# EAGLE design OMHOT (EAGLE 5.12)
VERSION: OMHOT_3_2

## Sheet 1 of 2
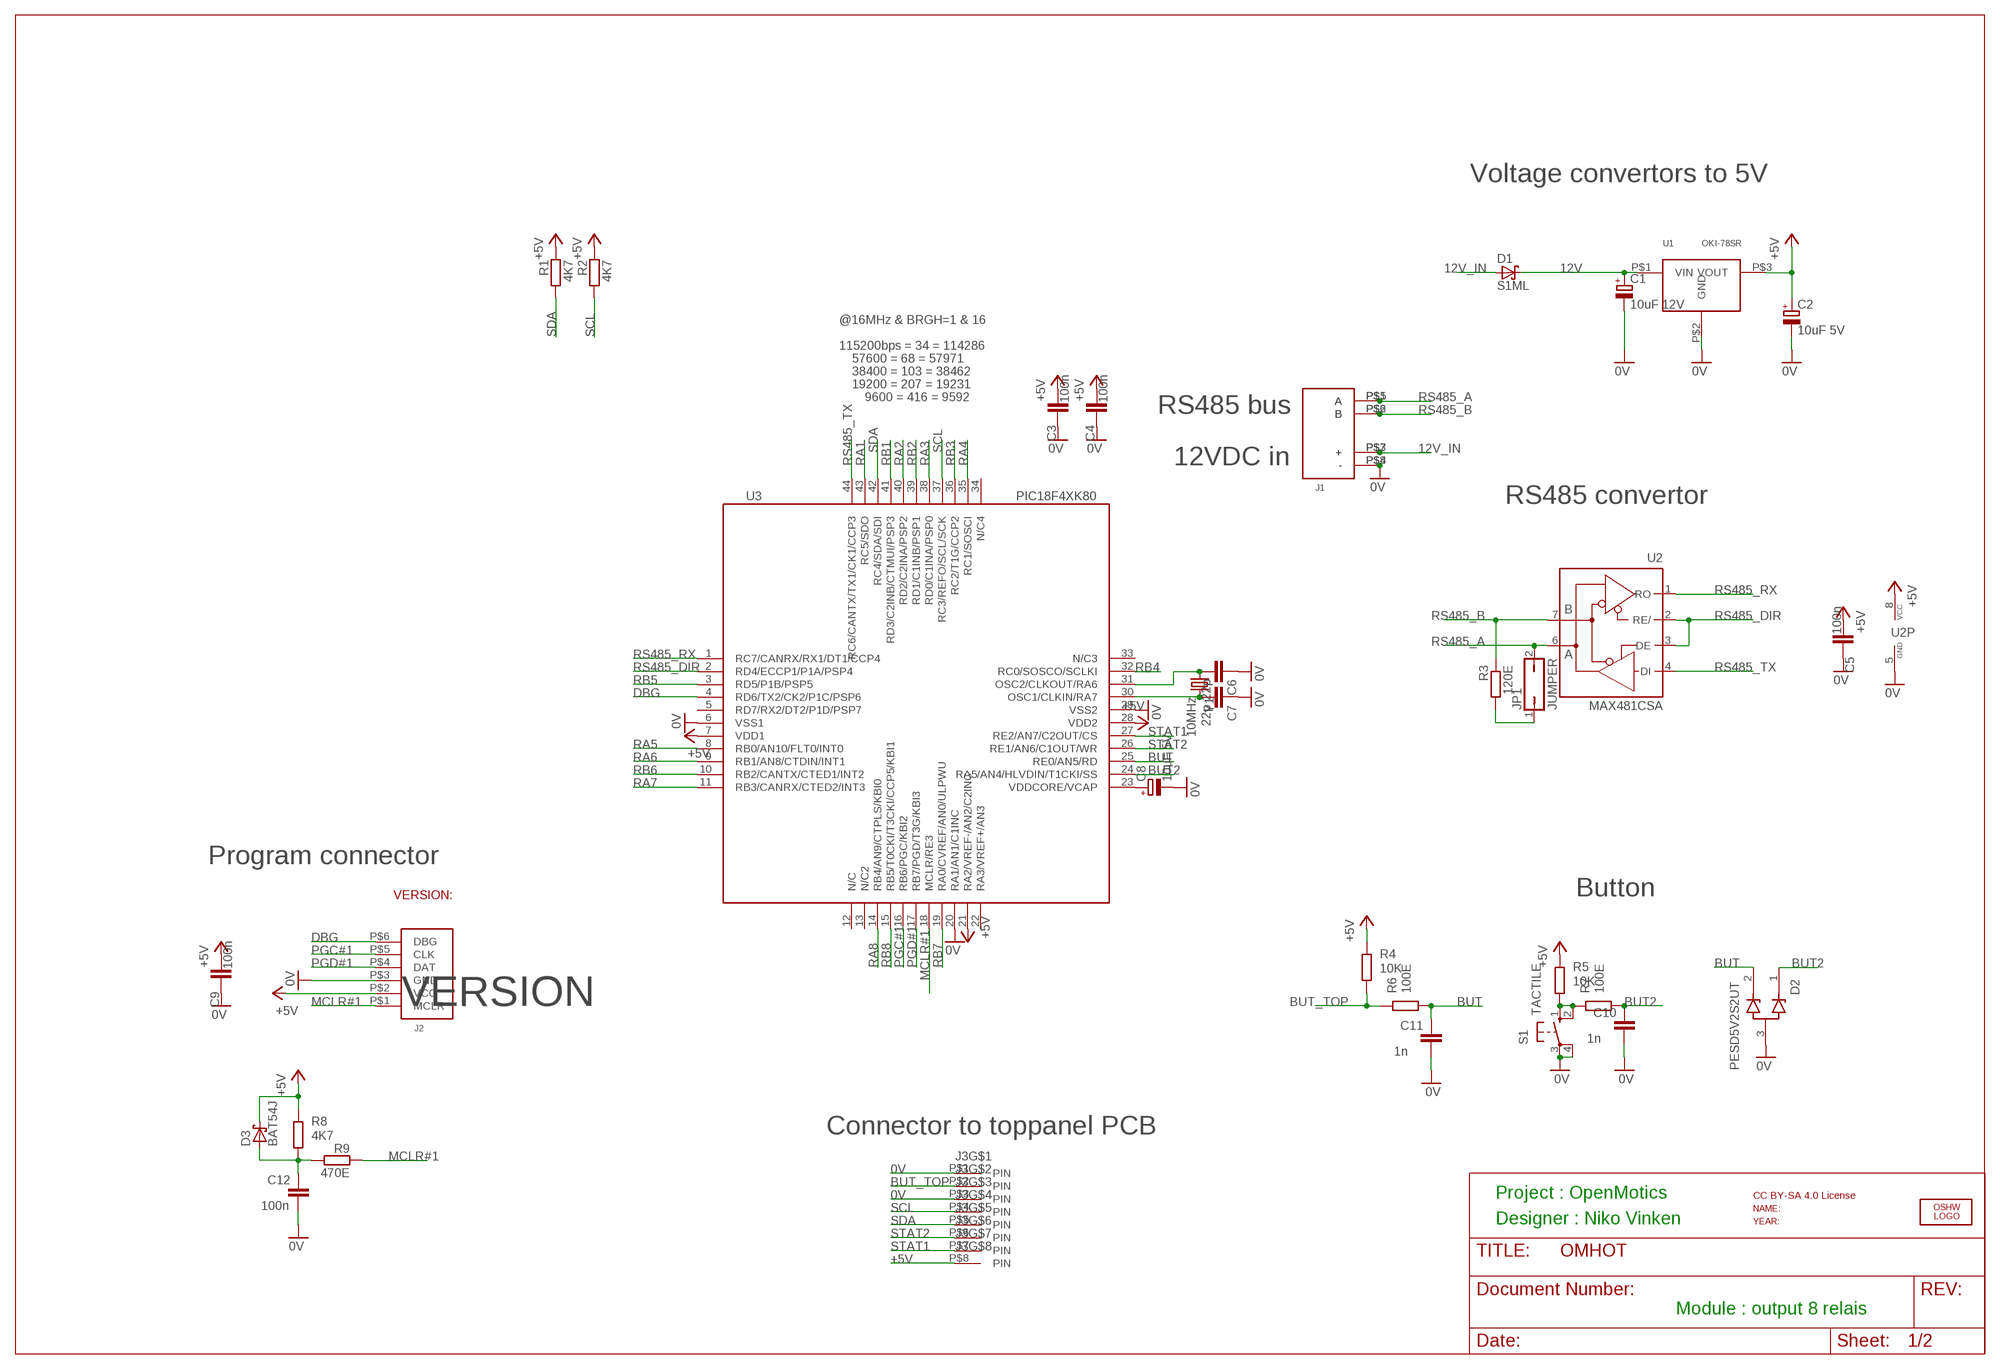
[diagram p0: schematic, sheet 1]

### Parts
C1  10uF 12V  CPOL-EUA3216-18W  [A3216-18W]
C2  10uF 5V  CPOL-EUA3216-18W  [A3216-18W]
C3  100n  C-EUC0603  [C0603]
C4  100n  C-EUC0603  [C0603]
C5  100n  C-EUC0603  [C0603]
C6  22p  C-EUC0603  [C0603]
C7  22p  C-EUC0603  [C0603]
C8  10uF 5V  CPOL-EUA3216-18W  [A3216-18W]
C9  100n  C-EUC0603  [C0603]
C10  1n  C-EUC0603  [C0603]
C11  1n  C-EUC0603  [C0603]
C12  100n  C-EUC0603  [C0603]
D1  S1ML  SMF5.0AT1  [SOD123FL]
D2  PESD5V2S2UT  PESD3V3S2UAT  [SOT23]
D3  BAT54J  [SOD323_REFLOW]
J1  PTDA_1.5_4-PH_5.0  [PTDA_1.5_X-PH_5.0]
J2  PROG_CON  [PROG_CON_WITH_VERSION]
J3  8PIN_CON_AMP  [8PIN_CON_AMP]
JP1  JUMPER  JP1Q  [JP1S]
LOGO2  OSHW_LOGO_FILLX0150-NT  [OSHW_FILLX150_NOTEXT]
R1  4K7  R-EU_R0603  [R0603]
R2  4K7  R-EU_R0603  [R0603]
R3  120E  R-EU_R1206  [R1206]
R4  10K  R-EU_R0603  [R0603]
R5  10K  R-EU_R0603  [R0603]
R6  100E  R-EU_R0603  [R0603]
R7  100E  R-EU_R0603  [R0603]
R8  4K7  R-EU_R0603  [R0603]
R9  470E  R-EU_R0603  [R0603]
S1  TACTILE  10-XX  [B3F-10XX]
U1  OKI-78SR  [OKI-78SR]
U2  MAX481CSA  [SO08]
U3  PIC18F4XK80  [TQFP44]
U$7  CC_BY_SA  [CC_BY_SA]
Y1  10MHz  CRYSTALSM49  [SM49]

### Nets
0V: C1.- C2.- C3.2 C4.2 C5.2 C6.1 C7.1 C8.- C9.2 C10.1 C11.1 C12.1 D2.3 J1.P$4(-) J1.P$8(-) J2.P$3(GND) J3.P$1 J3.P$3 S1.3(P) S1.4(P1) U1.P$2(GND) U2.5(GND) U3.6(VSS1) U3.20(RA1/AN1/C1INC) U3.29(VSS2) ; also sheet 2
12V: C1.+ D1.C U1.P$1(VIN)
12V_IN: D1.A J1.P$3(+) J1.P$7(+)
+5V: C2.+ C3.1 C4.1 C5.1 C9.1 D3.1 J2.P$2(VCC) J3.P$8 R1.1 R2.1 R4.2 R5.2 R8.2 U1.P$3(VOUT) U2.8(VCC) U3.7(VDD1) U3.21(RA2/VREF-/AN2/C2INC) U3.28(VDD2) ; also sheet 2
BUT: C11.2 D2.2 R6.1 U3.25(RE0/AN5/RD)
BUT2: C10.2 D2.1 R7.1 U3.24(RA5/AN4/HLVDIN/T1CKI/SS)
BUT3: R5.1 R7.2 S1.1(S) S1.2(S1)
BUT_TOP: J3.P$2 R4.1 R6.2
DBG: J2.P$6(DBG) U3.4(RD6/TX2/CK2/P1C/PSP6)
MCLR#1: J2.P$1(MCLR) R9.1 U3.18(MCLR/RE3)
N$30: C6.2 U3.31(OSC2/CLKOUT/RA6) Y1.1
N$32: C7.2 U3.30(OSC1/CLKIN/RA7) Y1.2
N$33: C8.+ U3.23(VDDCORE/VCAP)
N$36: JP1.1 R3.2
N$444: C12.2 D3.2 R8.1 R9.2
PGC#1: J2.P$5(CLK) U3.16(RB6/PGC/KBI2)
PGD#1: J2.P$4(DAT) U3.17(RB7/PGD/T3G/KBI3)
RA1: U3.43(RC5/SDO) ; also sheet 2
RA2: U3.40(RD2/C2INA/PSP2) ; also sheet 2
RA3: U3.38(RD0/C1INA/PSP0) ; also sheet 2
RA4: U3.35(RC1/SOSCI) ; also sheet 2
RA5: U3.8(RB0/AN10/FLT0/INT0) ; also sheet 2
RA6: U3.9(RB1/AN8/CTDIN/INT1) ; also sheet 2
RA7: U3.11(RB3/CANRX/CTED2/INT3) ; also sheet 2
RA8: U3.14(RB4/AN9/CTPLS/KBI0) ; also sheet 2
RB1: U3.41(RD3/C2INB/CTMUI/PSP3) ; also sheet 2
RB2: U3.39(RD1/C1INB/PSP1) ; also sheet 2
RB3: U3.36(RC2/T1G/CCP2) ; also sheet 2
RB4: U3.32(RC0/SOSCO/SCLKI) ; also sheet 2
RB5: U3.3(RD5/P1B/PSP5) ; also sheet 2
RB6: U3.10(RB2/CANTX/CTED1/INT2) ; also sheet 2
RB7: U3.19(RA0/CVREF/AN0/ULPWU) ; also sheet 2
RB8: U3.15(RB5/T0CKI/T3CKI/CCP5/KBI1) ; also sheet 2
RS485_A: J1.P$1(A) J1.P$5(A) JP1.2 U2.6(A)
RS485_B: J1.P$2(B) J1.P$6(B) R3.1 U2.7(B)
RS485_DIR: U2.2(RE/) U2.3(DE) U3.2(RD4/ECCP1/P1A/PSP4)
RS485_RX: U2.1(RO) U3.1(RC7/CANRX/RX1/DT1/CCP4)
RS485_TX: U2.4(DI) U3.44(RC6/CANTX/TX1/CK1/CCP3)
SCL: J3.P$4 R2.2 U3.37(RC3/REFO/SCL/SCK)
SDA: J3.P$5 R1.2 U3.42(RC4/SDA/SDI)
STAT1: J3.P$7 U3.27(RE2/AN7/C2OUT/CS)
STAT2: J3.P$6 U3.26(RE1/AN6/C1OUT/WR)
Unconnected: U3.5(RD7/RX2/DT2/P1D/PSP7) U3.12(N/C) U3.13(N/C2) U3.22(RA3/VREF+/AN3) U3.33(N/C3) U3.34(N/C4)

### Notes on the sheet
- Voltage convertors to 5V
- @16MHz & BRGH=1 & 16
- 115200bps = 34 = 114286
- 57600 = 68 = 57971
- 38400 = 103 = 38462
- 19200 = 207 = 19231
- 9600 = 416 = 9592
- RS485 bus
- 12VDC in
- RS485 convertor
- Program connector
- Button
- Connector to toppanel PCB
- Project : OpenMotics
- Designer : Niko Vinken
- Module : output 8 relais

## Sheet 2 of 2
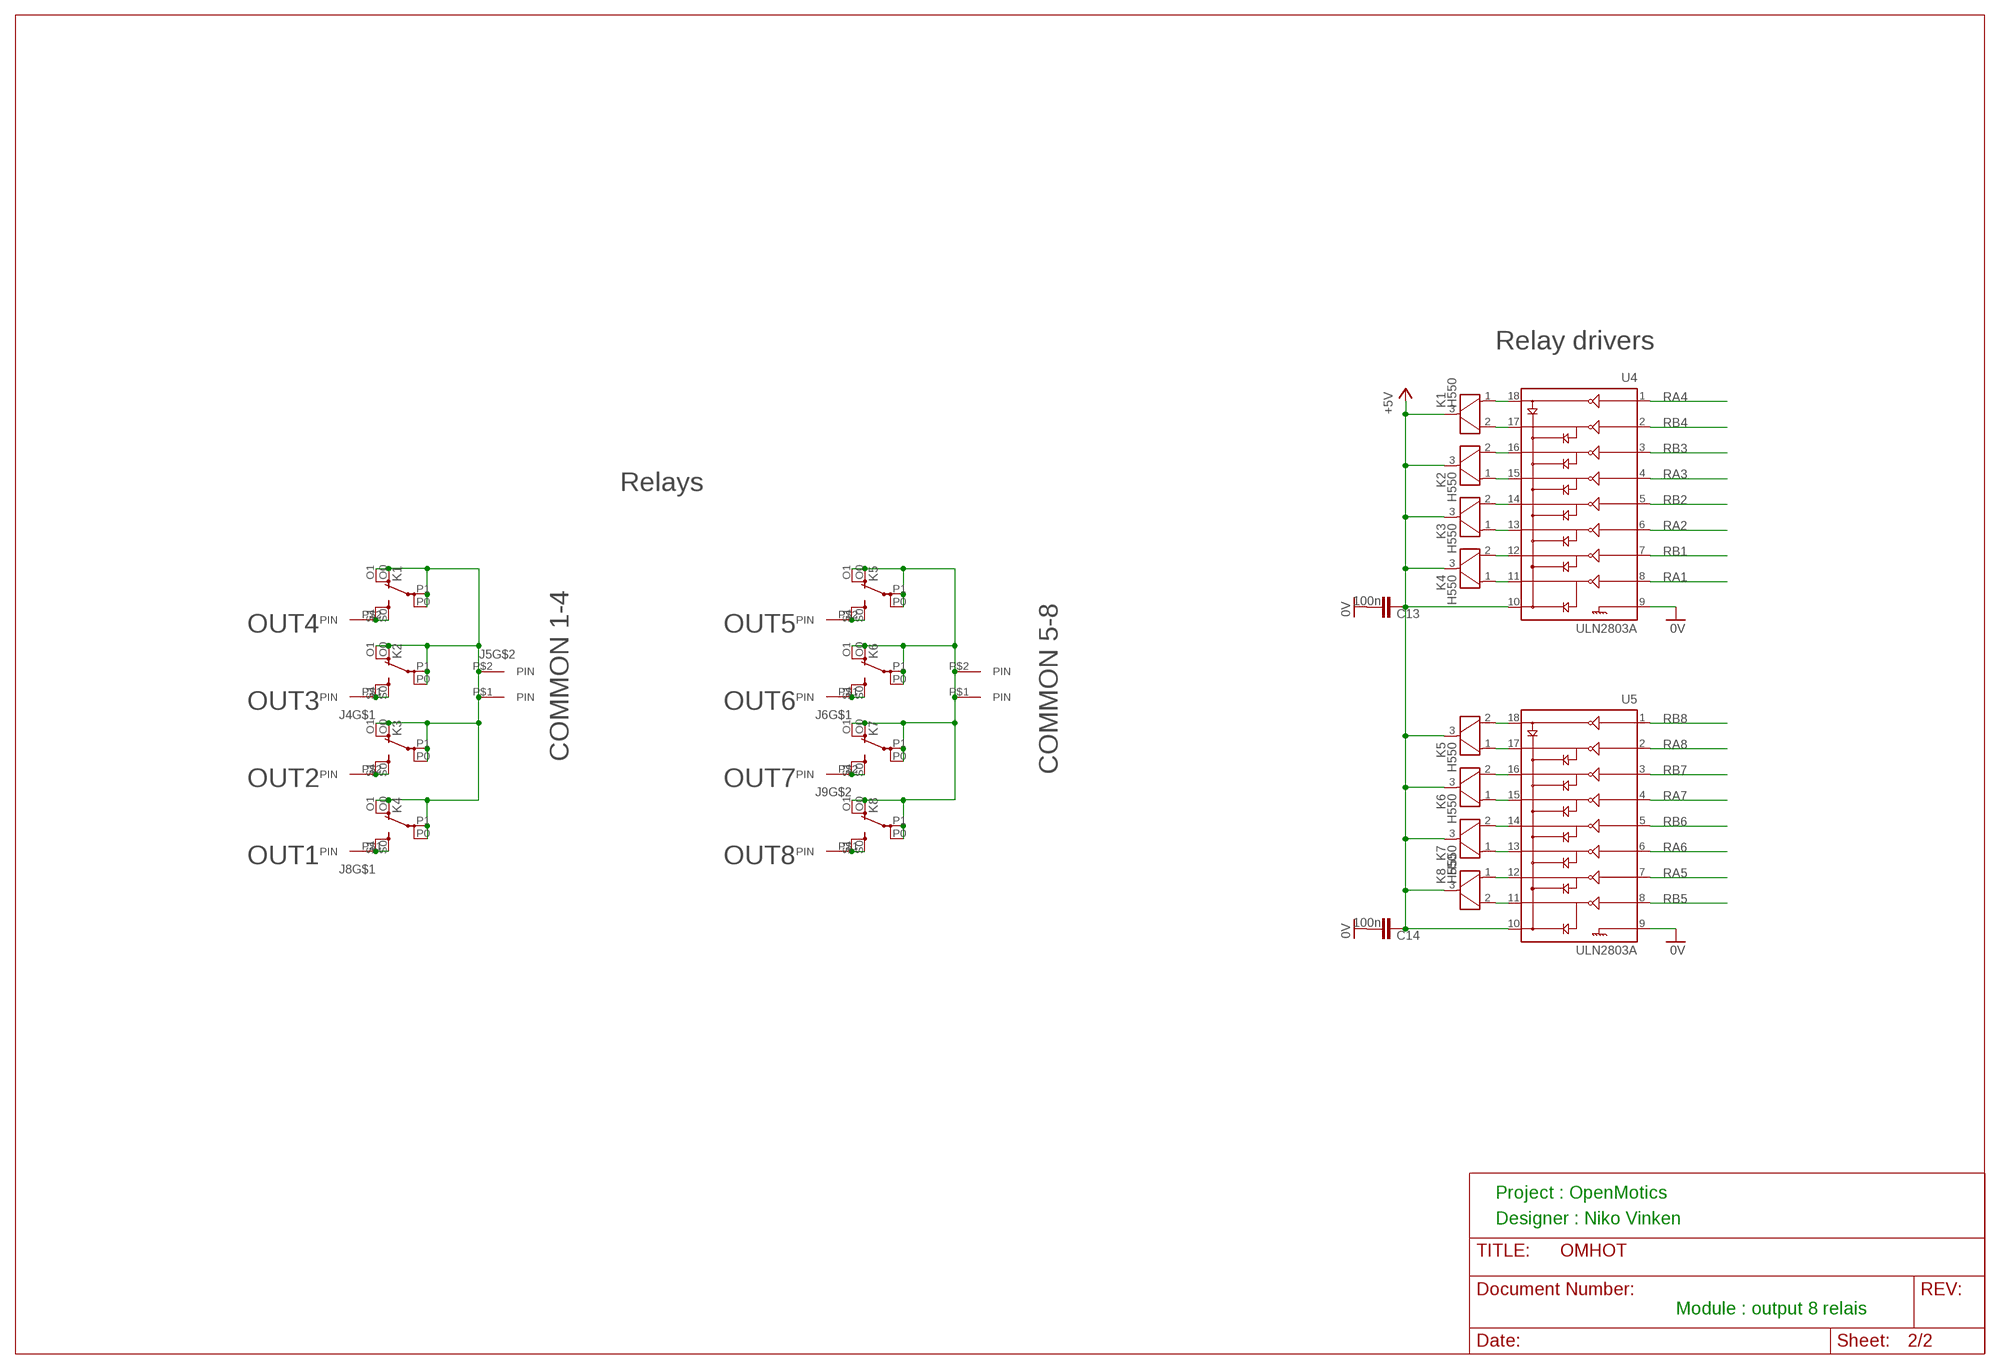
[diagram p1: schematic, sheet 2]

### Parts
C13  100n  C-EUC0603  [C0603]
C14  100n  C-EUC0603  [C0603]
J4  TERMINAL_2PIN  TERMINAL_2PIN7.62MM  [2PIN_TERMINAL_7.6MM]
J5  TERMINAL_2PIN  TERMINAL_2PIN7.62MM  [2PIN_TERMINAL_7.6MM]
J6  TERMINAL_2PIN  TERMINAL_2PIN7.62MM  [2PIN_TERMINAL_7.6MM]
J7  TERMINAL_2PIN  TERMINAL_2PIN7.62MM  [2PIN_TERMINAL_7.6MM]
J8  TERMINAL_2PIN  TERMINAL_2PIN7.62MM  [2PIN_TERMINAL_7.6MM]
J9  TERMINAL_2PIN  TERMINAL_2PIN7.62MM  [2PIN_TERMINAL_7.6MM]
K1  H550  [H550]
K2  H550  [H550]
K3  H550  [H550]
K4  H550  [H550]
K5  H550  [H550]
K6  H550  [H550]
K7  H550  [H550]
K8  H550  [H550]
U4  ULN2803A  [SOIC18]
U5  ULN2803A  [SOIC18]
U$4  CNMB/6  [CNMB/6-]  (not placed on a sheet)

### Nets
0V: C13.1 C14.1 U4.9 U5.9 ; also sheet 1
+5V: C13.2 C14.2 K1.3 K2.3 K3.3 K4.3 K5.3 K6.3 K7.3 K8.3 U4.10 U5.10 ; also sheet 1
N$1: J6.P$2 K5.S0(2:S) K5.S1(2:S)
N$3: J8.P$2 K3.S0(2:S) K3.S1(2:S)
N$4: J8.P$1 K4.S0(2:S) K4.S1(2:S)
N$5: J6.P$1 K6.S0(2:S) K6.S1(2:S)
N$6: K4.1 U4.11
N$7: K4.2 U4.12
N$8: J4.P$2 K1.S0(2:S) K1.S1(2:S)
N$9: K3.1 U4.13
N$10: J9.P$2 K7.S0(2:S) K7.S1(2:S)
N$11: J9.P$1 K8.S0(2:S) K8.S1(2:S)
N$12: J5.P$1 J5.P$2 K1.O0(2:O) K1.O1(2:O) K1.P0(2:P) K1.P1(2:P) K2.O0(2:O) K2.O1(2:O) K2.P0(2:P) K2.P1(2:P) K3.O0(2:O) K3.O1(2:O) K3.P0(2:P) K3.P1(2:P) K4.O0(2:O) K4.O1(2:O) K4.P0(2:P) K4.P1(2:P)
N$13: J4.P$1 K2.S0(2:S) K2.S1(2:S)
N$14: K3.2 U4.14
N$15: K2.1 U4.15
N$16: K2.2 U4.16
N$17: K1.1 U4.18
N$18: K1.2 U4.17
N$19: K5.1 U5.17
N$20: J7.P$1 J7.P$2 K5.O0(2:O) K5.O1(2:O) K5.P0(2:P) K5.P1(2:P) K6.O0(2:O) K6.O1(2:O) K6.P0(2:P) K6.P1(2:P) K7.O0(2:O) K7.O1(2:O) K7.P0(2:P) K7.P1(2:P) K8.O0(2:O) K8.O1(2:O) K8.P0(2:P) K8.P1(2:P)
N$21: K5.2 U5.18
N$22: K6.1 U5.15
N$23: K6.2 U5.16
N$24: K7.1 U5.13
N$25: K7.2 U5.14
N$26: K8.1 U5.12
N$27: K8.2 U5.11
RA1: U4.8 ; also sheet 1
RA2: U4.6 ; also sheet 1
RA3: U4.4 ; also sheet 1
RA4: U4.1 ; also sheet 1
RA5: U5.7 ; also sheet 1
RA6: U5.6 ; also sheet 1
RA7: U5.4 ; also sheet 1
RA8: U5.2 ; also sheet 1
RB1: U4.7 ; also sheet 1
RB2: U4.5 ; also sheet 1
RB3: U4.3 ; also sheet 1
RB4: U4.2 ; also sheet 1
RB5: U5.8 ; also sheet 1
RB6: U5.5 ; also sheet 1
RB7: U5.3 ; also sheet 1
RB8: U5.1 ; also sheet 1

### Notes on the sheet
- Relay drivers
- Relays
- OUT4 | OUT5
- OUT3 | OUT6
- COMMON 1-4
- COMMON 5-8
- OUT2 | OUT7
- OUT1 | OUT8
- Project : OpenMotics
- Designer : Niko Vinken
- Module : output 8 relais

## Library data of the parts
C1 C2 C8 = resistor:CPOL-EU: POLARIZED CAPACITOR, European symbol
C3-C7 C9-C14 = resistor:C-EU: CAPACITOR, European symbol
D1 = diode:SMF5.0AT1: 200 W Transient Voltage Suppressor Source: Data sheet <http://www.onsemi.com/pub_link/Collateral/SMF5.0AT1-D.PDF>
D2 = OpenMotics:PESD3V3S2UAT
D3 = OpenMotics:BAT54J
J1 = OpenMotics:PTDA_1.5_4-PH_5.0
J2 = OpenMotics:PROG_CON
J3 = OpenMotics:8PIN_CON_AMP
J4-J9 = OpenMotics:TERMINAL_2PIN
JP1 = jumper:JP1Q: JUMPER
K1-K8 = relay:H550: RELAY bistable, 1 x switch, high current
LOGO2 = ohw-logo:OSHW_LOGO_FILL
R1-R9 = resistor:R-EU_: RESISTOR, European symbol
S1 = switch-omron:10-XX: OMRON SWITCH; MPN: B3F-1000; OC_FARNELL: 176432; OC_NEWARK: 36M3542
U1 = OpenMotics:OKI-78SR
U2 = maxim:MAX481CSA: RS485 TRANSEIVER
U3 = OpenMotics:PIC18F4XK80
U4 U5 = OpenMotics:ULN2803A
U$4 = OpenMotics:CNMB/6
U$7 = OpenMotics:CC_BY_SA
Y1 = crystal:CRYSTAL: CRYSTAL

## Board
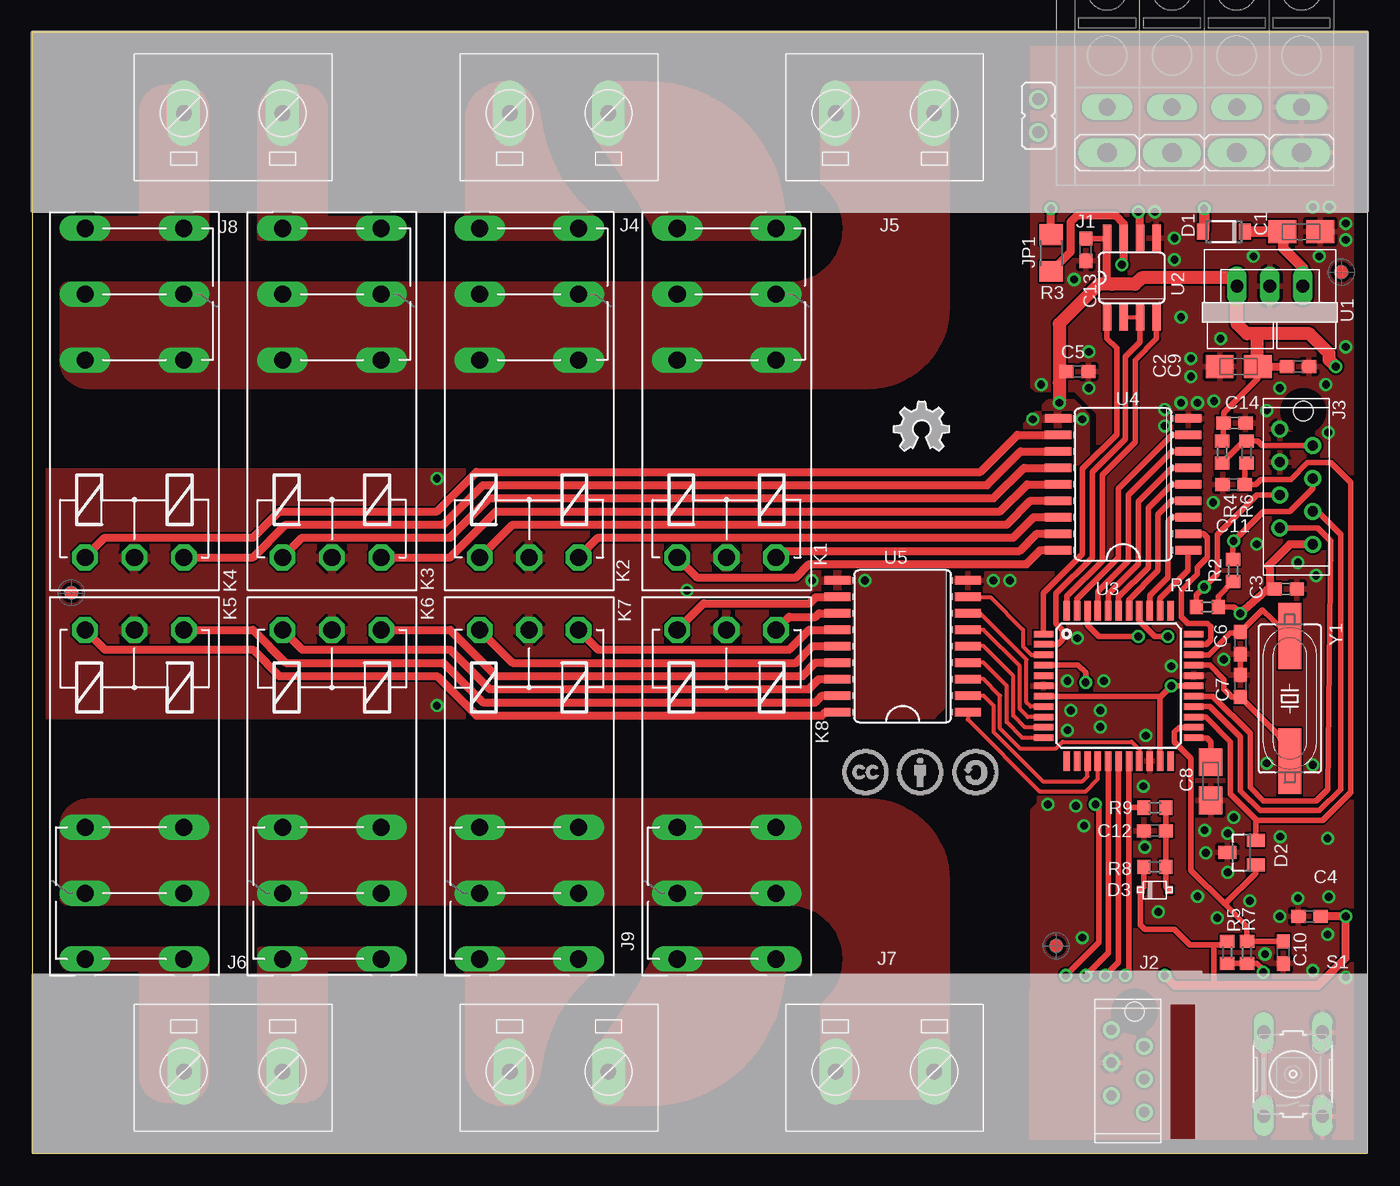
[diagram p2: board, top side]
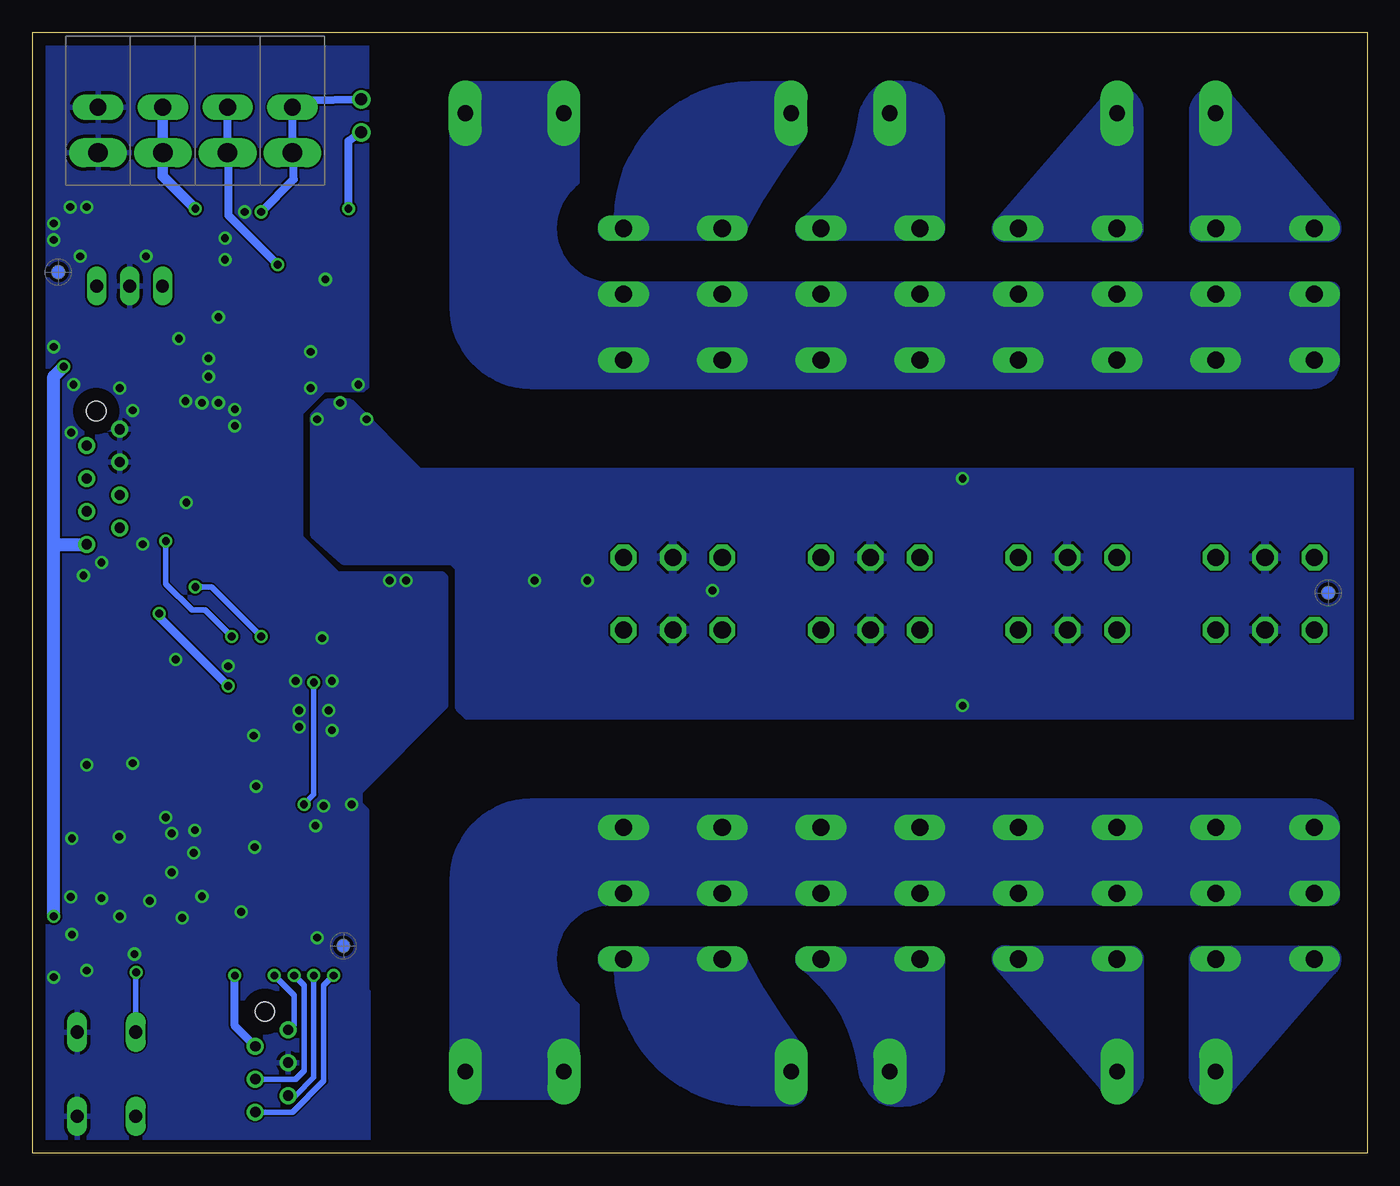
[diagram p3: board, bottom side, seen from below]

Size 103 x 86.5 mm. Coordinates in mm from the lower left corner, seen from the top.
Outline: 0,0 103,0 103,86.5 0,86.5 0,0
Copper layers (1+16): Top 0.035mm / dielectric 1.5mm / Bottom 0.035mm
Design rules "default *": minimum track width 10mil, minimum drill 24mil, track to track 6mil, track to pad 6mil, pad to pad 6mil, via to via 6mil, smd to smd 6mil, copper to edge 40mil, drill to drill 8mil, minimum pad ring 10mil, minimum via ring 8mil, stop-mask expansion 4mil, vias tented up to drill 0mil, thermal gap 10mil

### Footprints (pad centres in the part's own frame; a part is rotated, then mirrored left to right if it is on the bottom)
A3216-18W = smd 2.15 x 1.8: + 1.475,0; - -1.475,0
C0603 = smd 1.1 x 1: 1 -0.85,0; 2 0.85,0
SOD123FL = smd 0.91 x 1.22: A 1.625,0; C -1.625,0
SOT23 = smd 1 x 1.4: 1 -0.95,-1.1; 2 0.95,-1.1; 3 0,1.1
SOD323_REFLOW = smd 0.6 x 0.6: 1 1.1,0; 2 -1.1,0
PTDA_1.5_X-PH_5.0 = drill 1.5 long: P$1 0,0; P$2 5,0; P$3 10,0; P$4 15,0 | drill 1.3 long: P$5 0,3.5; P$6 5,3.5; P$7 10,3.5; P$8 15,3.5
PROG_CON_WITH_VERSION = drill 0.8 round: P$1 0,0; P$2 -2.54,1.27; P$3 0,2.54; P$4 -2.54,3.81; P$5 0,5.08; P$6 -2.54,6.35 | hole 1.5: -1.8,-1.4
8PIN_CON_AMP = drill 0.8 round: P$1 0,0; P$2 1.27,2.54; P$3 2.54,0; P$4 3.81,2.54; P$5 5.08,0; P$6 6.35,2.54; P$7 7.62,0; P$8 8.89,2.54 | hole 1.5: -1.4,1.8
2PIN_TERMINAL_7.6MM = drill 1.2 pad 2.54 long: P$1 -3.81,0; P$2 3.81,0
JP1S = drill 0.914 round: 1 1.27,1.27; 2 1.27,3.81
H550 = drill 1.321 octagon: 1 -7.62,3.81; 2 -7.62,-3.81; 3 -7.62,0 | drill 1.321 long: O0 7.62,3.81; O1 7.62,-3.81; P0 12.7,3.81; P1 12.7,-3.81; S0 17.78,3.81; S1 17.78,-3.81
R0603 = smd 1 x 1.1: 1 -0.85,0; 2 0.85,0
R1206 = smd 1.6 x 1.803: 1 -1.422,0; 2 1.422,0
B3F-10XX = drill 1.016 long: 1 -3.251,2.261; 2 3.251,2.261; 3 -3.251,-2.261; 4 3.251,-2.261
OKI-78SR = drill 1 long: P$1 0,0; P$2 2.54,0; P$3 5.08,0
SO08 = smd 0.66 x 2.032: 1 -1.905,-3.073; 2 -0.635,-3.073; 3 0.635,-3.073; 4 1.905,-3.073; 5 1.905,3.073; 6 0.635,3.073; 7 -0.635,3.073; 8 -1.905,3.073
TQFP44 = smd 1.5 x 0.5: 1 -5.8,4; 2 -5.8,3.2; 3 -5.8,2.4; 4 -5.8,1.6; 5 -5.8,0.8; 6 -5.8,0; 7 -5.8,-0.8; 8 -5.8,-1.6; 9 -5.8,-2.4; 10 -5.8,-3.2; 11 -5.8,-4; 23 5.8,-4; 24 5.8,-3.2; 25 5.8,-2.4; 26 5.8,-1.6; 27 5.8,-0.8; 28 5.8,0; 29 5.8,0.8; 30 5.8,1.6; 31 5.8,2.4; 32 5.8,3.2; 33 5.8,4 | smd 0.5 x 1.5: 12 -4,-5.8; 13 -3.2,-5.8; 14 -2.4,-5.8; 15 -1.6,-5.8; 16 -0.8,-5.8; 17 0,-5.8; 18 0.8,-5.8; 19 1.6,-5.8; 20 2.4,-5.8; 21 3.2,-5.8; 22 4,-5.8; 34 4,5.8; 35 3.2,5.8; 36 2.4,5.8; 37 1.6,5.8; 38 0.8,5.8; 39 0,5.8; 40 -0.8,5.8; 41 -1.6,5.8; 42 -2.4,5.8; 43 -3.2,5.8; 44 -4,5.8
SOIC18 = smd 0.66 x 2.032: 1 1.27,0.051; 2 2.54,0.051; 3 3.81,0.051; 4 5.08,0.051; 5 6.35,0.051; 6 7.62,0.051; 7 8.89,0.051; 8 10.16,0.051; 9 11.43,0.051; 10 11.43,10.109; 11 10.16,10.109; 12 8.89,10.109; 13 7.62,10.109; 14 6.35,10.109; 15 5.08,10.109; 16 3.81,10.109; 17 2.54,10.109; 18 1.27,10.109
SM49 = smd 5.08 x 1.778: 1 -4.826,0; 2 4.826,0

### Placement (x,y rotation side)
C1  97.92,71.12 180 top
C2  93.09,60.71 0 top
C3  96.72,43.53 0 top
C4  98.55,18.29 180 top
C5  80.64,60.33 0 top
C6  93.22,39.37 90 top
C7  93.22,36.07 270 top
C8  90.93,28.7 90 top
C9  97.66,60.71 0 top
C10  96.52,15.49 90 top
C11  92.7,51.6 0 top
C12  86.61,24.89 0 top
C13  81.28,69.72 90 top
C14  92.76,56.36 180 top
D1  91.95,71.12 180 top
D2  93.3,23.2 90 top
D3  86.61,20.32 180 top
J1  82.94,77.22 0 top
J2  83.26,9.53 180 top
J3  96.27,55.88 270 top
J4  40.64,80.26 0 top
J5  65.79,80.26 0 top
J6  15.49,6.3 180 top
J7  65.79,6.3 180 top
J8  15.49,80.26 0 top
J9  40.64,6.3 180 top
JP1  76.36,77.52 0 top
K1  53.57,53.59 90 top
K2  38.33,53.59 90 top
K3  23.11,53.59 90 top
K4  7.87,53.59 90 top
K5  7.87,32.77 270 top
K6  23.11,32.77 270 top
K7  38.33,32.77 270 top
K8  53.57,32.77 270 top
LOGO2  66.5,54.2 0 top
R1  90.66,42.15 180 top
R2  92.65,44.96 90 top
R3  78.61,69.47 90 top
R4  91.8,54.1 90 top
R5  92.2,15.49 90 top
R6  93.7,54.1 90 top
R7  93.73,15.49 270 top
R8  86.61,22.1 180 top
R9  86.61,26.67 0 top
S1  97.28,6.1 90 top
U1  98.04,66.93 180 top
U2  84.84,67.56 0 top
U3  83.82,36.07 0 top
U4  89.25,45.27 90 top
U5  72.24,32.78 90 top
U$1  [FIDUCIAL_G10]  101,68 0 bottom
U$2  [FIDUCIAL_G10]  79,16 0 top
U$3  [FIDUCIAL_G10]  101,68 0 top
U$4  -1.5,-1.75 0 top
U$5  [FIDUCIAL_G10]  3,43.25 0 top
U$6  [FIDUCIAL_G10]  3,43.25 0 bottom
U$7  68.5,29.4 0 top
U$12  [FIDUCIAL_G10]  79,16 0 bottom
Y1  97.03,35.08 270 top

### Tracks (layer width: path | path; a pad name or v marks a point on that pad's centre or on a via)
0V  (via drill 0.6)
  Top 0.406: C7.1 C6.1
  other vias: 89.92,57.91 88.65,57.91 87.38,57.4 87.38,56.13 91.19,58.04 88.14,70.61 86.61,72.64 80.39,67.44 77.85,59.31 81.53,59.05 87.88,37.59 91.95,38.1 90.46,24.93 92.71,25.91 85.85,23.62 89.92,19.81 98.81,14.1 74.17,44.2 75.44,44.2 94.49,47 95.12,15.37 96.27,18.29 97.66,19.68 91.44,18.16 90.55,23.18 81.03,16.64 80.52,26.8 78.36,26.92 79.88,32.64 85.93,32.23 80.64,39.75 79.88,36.45 97.66,45.59 99.06,44.58 98.81,29.97 95.25,30.1 99.95,24.29 91.12,50.22 95.27,57.33 101.35,62.23 88.65,64.52 88.14,68.96 81.53,61.85 89.41,59.94 89.41,61.34 86.9,18.62 92.25,24.68 92.25,21.68 93.95,19.48 96.3,24.43 100.05,19.78 99.95,16.88 100.01,55.61 91.69,62.87 99.82,59.31 96.27,59.05 94.23,69.22 98.81,73.03 100.08,73.03 101.35,71.75 101.35,70.48 99.31,69.22 101.35,13.59 80.14,34.16 82.42,34.16 82.42,32.89 85.72,28.32 81.15,25.27 82.68,36.45
  pour Top: 77.22,86.36 77.22,59.18 77.47,58.93 80.52,58.93 82.3,57.15 82.3,47.5 79.5,44.7 71.37,44.7 71.12,44.45 71.12,34.54 77.72,27.94 77.72,26.92 77.22,26.42 77.22,12.45 77.09,12.45 77.09,0.25 102.87,0.25 102.87,86.36
  pour Bottom: 77.22,86.36 77.22,59.18 77.47,58.93 80.52,58.93 82.3,57.15 82.3,47.5 79.5,44.7 71.37,44.7 71.12,44.45 71.12,34.54 77.72,27.94 77.72,26.92 77.22,26.42 77.22,12.45 77.09,12.45 77.09,0.25 102.87,0.25 102.87,86.36
12V
  Top 0.813: D1.C C1.+ 96.52,71.04 96.52,69.85 98.04,68.33 U1.P$1
12V_IN  (via drill 0.6)
  Top 0.813: v90.42,72.9 90.42,71.22 D1.A
  Bottom 0.813: J1.P$7 J1.P$3 92.94,75.41 v90.42,72.9
+5V  (via drill 0.6)
  Top 0.406: 91.27,16.09 92.29,16.09 92.46,16.26 R5.2 | 91.27,16.09 91.19,16 91.19,12.95 | C13.2 82.87,70.57 U2.8 | C5.1 79.38,59.56 79.25,59.44 | R8.2 85.76,20.57 D3.1 85.51,17.61 85.85,17.27 88.14,17.27 89.32,16.09 91.27,16.09 | U3.7 87.08,35.27 v87.88,36.07 | v87.88,36.07 U3.28 | C3.1 95.52,43.57 95.36,45.32 | R4.2 91.9,54.95 C14.2 91.93,57.18 92.5,57.7 94.57,59.77 C2.+ | R2.1 91.51,42.96 R1.1 92.72,42.15 v93.22,41.66 | U3.21 87.02,35.2 v87.88,36.07
  Top 0.61: U2.8 82.93,67.06 83.31,67.06 | J3.P$8 97.03,46.99 95.36,45.32 95.48,45.19 95.48,43.67 v93.22,41.66 | C4.1 v101.35,18.29 101.35,15.06 99.24,12.95 91.19,12.95 88.14,12.95 v87.38,13.72 | C2.+ C9.1
  Top 1.016: v79.25,57.91 79.25,59.44 79.25,64.01 82.3,67.06 83.31,67.06 85.09,67.06 85.6,67.56 92.33,67.56 U1.P$3 92.96,64.01 93.73,63.25 94.49,63.25 | v100.58,60.71 100.08,61.21 100.08,61.72 98.55,63.25 94.49,63.25 | C2.+ 94.49,60.78 94.49,63.25
  Bottom 0.61: v93.22,41.66 93.22,41.4 v87.88,36.07 | J2.P$2 87.38,9.83 v87.38,13.72
  Bottom 1.016: 101.35,46.99 101.35,59.94 v100.58,60.71 | 101.35,46.99 J3.P$8 | v101.35,18.29 101.35,46.99
  other vias: 77.22,56.64 81.03,56.64 50.52,43.43 31.22,52.07 31.22,34.54 64.24,44.2 60.17,44.2
  pour Bottom: 0.25,52.58 73.15,52.58 78.49,57.91 80.26,57.91 81.28,56.9 81.28,47.75 78.99,45.72 70.61,45.72 70.1,45.21 70.1,34.42 69.47,33.78 0.25,33.78
  pour Top: 0.25,52.58 73.15,52.58 78.49,57.91 80.26,57.91 81.28,56.9 81.28,47.75 78.99,45.72 70.61,45.72 70.1,45.21 70.1,34.42 69.47,33.78 0.25,33.78
BUT
  Top 0.406: 94.4,25.77 94.49,25.68 99.57,25.68 101.73,27.84 101.73,51.77 100.2,53.3 98.4,53.3 97.1,52 94.8,52 94.4,51.6 C11.2 93.55,53.25 R6.1 | D2.2 94.4,25.77 | 94.4,25.77 92.46,27.71 92.46,31.75 90.54,33.67 U3.25
BUT2
  Top 0.406: 92.03,19.23 93.73,17.53 R7.1 C10.2 96.69,16.34 | 92.03,19.23 89.41,21.84 89.41,30.48 88.14,31.75 88.14,32.51 88.49,32.87 U3.24 | D2.1 94.4,21.6 92.03,19.23
BUT3  (via drill 0.6)
  Top 0.406: S1.1 S1.2 | R5.1 R7.2 94.49,14.64 95.02,14.16 95,14.14 v95,13.97
  Bottom 0.406: S1.2 95.02,12.93 v95,13.97
BUT_TOP
  Top 0.406: 94.91,54.61 J3.P$2 | 94.91,54.61 95,54.6 | 94.91,54.61 94.57,54.95 R6.2 93.5,54.95 R4.1
DBG  (via drill 0.6)
  Top 0.406: U3.4 80.7,37.67 81.28,37.08 v81.28,36.32 | v82.04,26.92 82.3,26.67 82.3,16.26 v79.76,13.72
  Bottom 0.406: v81.28,36.32 81.28,27.69 v82.04,26.92 | v79.76,13.72 80.52,12.95 80.52,5.59 82.93,3.17 J2.P$6
MCLR#1  (via drill 0.6)
  Top 0.406: 84.62,26.67 U3.18 | 84.62,26.67 R9.1 | v84.33,13.72 84.62,14.01 84.62,26.67
  Bottom 0.406: J2.P$1 83.19,9.53 82.8,9.91 82.8,12.19 v84.33,13.72
N$1
  pour Bottom (no thermals): 11.68,4.32 arc90 13.46,6.1 13.46,14.99 arc90 12.7,15.75 3.05,15.75 arc90 2.29,14.99 arc53 2.79,13.97 10.92,4.57 arc61
  pour Top (no thermals): 11.68,4.06 arc90 13.46,5.84 13.46,14.99 arc90 12.7,15.75 3.05,15.75 arc90 2.29,14.99 arc90 3.05,14.22 8.38,14.22 8.38,7.37 8.38,6.1 arc90 10.41,4.06
N$3
  pour Bottom (no thermals): 27.69,70.61 18.29,70.61 arc-90 17.53,71.37 17.53,80.26 arc-90 19.3,82.04 19.56,82.04 20.07,81.53 28.45,71.88 arc-29 28.7,71.37 arc-90 27.94,70.61
  pour Top (no thermals): 20.83,82.3 arc-90 22.61,80.52 22.61,72.14 27.94,72.14 arc-90 28.7,71.37 arc-90 27.94,70.61 17.53,70.61 17.53,80.26 arc-90 19.56,82.3
N$4
  pour Bottom (no thermals): 11.68,82.04 arc-90 13.46,80.26 13.46,71.37 arc-90 12.7,70.61 3.05,70.61 arc-90 2.29,71.37 arc-53 2.79,72.39 10.92,81.79 arc-61
  pour Top (no thermals): 11.68,82.3 arc-90 13.46,80.52 13.46,71.37 arc-90 12.7,70.61 3.05,70.61 arc-90 2.29,71.37 arc-90 3.05,72.14 8.38,72.14 8.38,78.99 8.38,80.26 arc-90 10.41,82.3
N$5
  pour Bottom (no thermals): 27.69,15.75 18.29,15.75 arc90 17.53,14.99 17.53,6.1 arc90 19.3,4.32 19.56,4.32 20.07,4.83 28.45,14.48 arc29 28.7,14.99 arc90 27.94,15.75
  pour Top (no thermals): 20.83,4.06 arc90 22.61,5.84 22.61,14.22 27.94,14.22 arc90 28.7,14.99 arc90 27.94,15.75 17.53,15.75 17.53,6.1 arc90 19.56,4.06
N$6
  Top 0.61: K4.1 5.59,47.5 17.02,47.5 19.05,49.53 31.22,49.53 34.27,52.58 73.15,52.58 76.01,55.43 U4.11
N$7
  Top 0.61: K4.2 17.02,45.97 19.56,48.51 31.73,48.51 34.77,51.56 73.66,51.56 76.26,54.16 U4.12
N$8
  pour Bottom (no thermals): 48.77,70.61 58.42,70.61 arc90 59.18,71.37 arc90 58.42,72.14 58.17,72.14 57.91,72.14 arc90 47.5,82.55 44.45,82.55 arc90 43.43,81.53 43.43,78.99 arc37 43.69,78.23 arc-9 48.01,71.37 arc35
  pour Top (no thermals): 48.77,70.61 58.42,70.61 arc90 59.18,71.37 arc90 58.42,72.14 58.17,72.14 57.91,72.14 arc90 47.5,82.55 44.45,82.55 arc90 43.43,81.53 43.43,78.99 arc37 43.69,78.23 arc-9 48.01,71.37 arc35
N$9
  Top 0.61: K3.1 20.83,47.5 32.23,47.5 35.28,50.55 74.17,50.55 76.52,52.89 U4.13
N$10
  pour Bottom (no thermals): 33.53,15.75 43.18,15.75 arc-90 43.94,14.99 arc-53 43.69,14.48 arc46 39.12,6.6 arc-48 37.59,4.06 arc-34 35.56,3.81 arc-90 32.77,6.86 32.77,14.99 arc-90
  pour Top (no thermals): 34.29,15.75 43.18,15.75 arc-90 43.94,14.99 arc-53 43.69,14.48 arc46 39.12,6.6 arc-48 37.59,4.06 arc-34 36.32,3.81 arc-90 33.53,6.86 33.53,14.99 arc-90
N$11
  pour Bottom (no thermals): 48.77,15.75 58.42,15.75 arc-90 59.18,14.99 arc-90 58.42,14.22 58.17,14.22 57.91,14.22 arc-90 47.5,3.81 44.45,3.81 arc-90 43.43,4.83 43.43,7.37 arc-37 43.69,8.13 arc9 48.01,14.99 arc-35
  pour Top (no thermals): 48.77,15.75 58.42,15.75 arc-90 59.18,14.99 arc-90 58.42,14.22 58.17,14.22 57.91,14.22 arc-90 47.5,3.81 44.45,3.81 arc-90 43.43,4.83 43.43,7.37 arc-37 43.69,8.13 arc9 48.01,14.99 arc-35
N$12
  pour Top (no thermals): 2.79,67.06 58.42,67.06 arc90 62.74,71.37 arc53 60.96,74.93 60.96,81.53 arc-90 61.98,82.55 69.6,82.55 arc-90 70.61,81.53 70.61,65.28 arc-90 64.52,59.18 4.32,59.18 arc-90 2.29,61.21 2.29,66.55 arc-90
  pour Bottom (no thermals): 2.79,67.06 58.42,67.06 arc90 62.74,71.37 arc53 60.96,74.93 60.96,81.53 arc-90 61.98,82.55 69.6,82.55 arc-90 70.61,81.53 70.61,65.28 arc-90 64.52,59.18 4.32,59.18 arc-90 2.29,61.21 2.29,66.55 arc-90
N$13
  pour Bottom (no thermals): 33.53,70.61 43.18,70.61 arc90 43.94,71.37 arc53 43.69,71.88 arc-46 39.12,79.76 arc48 37.59,82.3 arc34 35.56,82.55 arc90 32.77,79.5 32.77,71.37 arc90
  pour Top (no thermals): 34.29,70.61 43.18,70.61 arc90 43.94,71.37 arc53 43.69,71.88 arc-46 39.12,79.76 arc48 37.59,82.3 arc34 36.32,82.55 arc90 33.53,79.5 33.53,71.37 arc90
N$14
  Top 0.61: K3.2 32.23,45.97 35.79,49.53 74.68,49.53 76.77,51.62 U4.14
N$15
  Top 0.61: K2.1 37.06,48.51 75.18,48.51 77.02,50.35 U4.15
N$16
  Top 0.61: K2.2 43.66,47.5 75.69,47.5 77.28,49.08 U4.16
N$17
  Top 0.61: K1.1 51.28,44.45 58.93,44.45 59.94,45.47 76.71,45.47 77.79,46.54 U4.18
N$18
  Top 0.61: K1.2 57.4,45.97 57.91,46.48 76.2,46.48 77.53,47.81 U4.17
N$19
  Top 0.61: K5.1 17.02,40.39 19.56,37.85 31.73,37.85 34.77,34.8 60.45,34.8 60.95,35.32 U5.17
N$20
  pour Bottom (no thermals): 2.79,19.3 58.42,19.3 arc-90 62.74,14.99 arc-53 60.96,11.43 60.96,4.83 arc90 61.98,4.32 69.6,4.32 arc90 70.61,4.83 70.61,21.08 arc90 64.52,27.18 4.32,27.18 arc90 2.29,25.15 2.29,19.81 arc90
  pour Top (no thermals): 2.79,19.3 58.42,19.3 arc-90 62.74,14.99 arc-53 60.96,11.43 60.96,4.83 arc90 61.98,4.32 69.6,4.32 arc90 70.61,4.83 70.61,21.08 arc90 64.52,27.18 4.32,27.18 arc90 2.29,25.15 2.29,19.81 arc90
N$21
  Top 0.61: K5.2 5.59,38.86 17.02,38.86 19.05,36.83 31.22,36.83 34.27,33.78 60.96,33.78 61.2,34.05 U5.18
N$22
  Top 0.61: K6.1 32.23,40.39 35.79,36.83 59.44,36.83 60.44,37.86 U5.15
N$23
  Top 0.61: K6.2 20.83,38.86 32.23,38.86 35.28,35.81 59.94,35.81 60.69,36.59 U5.16
N$24
  Top 0.61: K7.1 43.66,38.86 58.42,38.86 59.93,40.4 U5.13
N$25
  Top 0.61: K7.2 37.06,37.85 58.93,37.85 60.19,39.13 U5.14
N$26
  Top 0.61: K8.1 58.4,41.4 60.45,41.4 60.72,41.67 U5.12
N$27
  Top 0.61: K8.2 51.8,42.43 59.96,42.43 60.45,42.93 U5.11
N$30
  Top 0.406: U3.31 90.79,38.47 92.46,40.13 93.13,40.13 C6.2 94.91,41.91 Y1.1
N$32
  Top 0.406: U3.30 90.86,37.67 91.95,36.58 91.95,35.81 92.54,35.22 C7.2 96.18,32.26 Y1.2
N$33
  Top 0.406: U3.23 90.61,32.07 90.93,31.75 C8.+
N$36  (via drill 0.6)
  Top 0.61: R3.2 v78.61,72.9
  Bottom 0.61: v78.61,72.9 78.61,78.11 JP1.1
N$444
  Top 0.406: R9.2 C12.2 R8.1 87.46,20.57 D3.2
PGC#1  (via drill 0.6)
  Top 0.406: v81.28,13.72 83.02,15.46 U3.16
  Bottom 0.406: J2.P$5 82.68,4.45 81.28,5.84 v81.28,13.72
PGD#1  (via drill 0.6)
  Top 0.406: v82.8,13.72 83.82,14.73 U3.17
  Bottom 0.406: J2.P$4 82.68,5.71 82.04,6.35 82.04,12.95 v82.8,13.72
RA1
  Top 0.406: U3.43 80.62,42.77 83.82,45.97 83.82,51.31 87.95,55.43 U4.8
RA2
  Top 0.406: U3.40 83.02,43.14 85.34,45.47 85.34,50.29 87.95,52.89 U4.6
RA3
  Top 0.406: U3.38 84.62,42.71 86.87,44.96 86.87,49.28 87.95,50.35 U4.4
RA4
  Top 0.406: U3.35 87.02,42.82 89.15,44.96 89.15,46.49 U4.1
RA5
  Top 0.305: U5.7 73.14,41.67 76.71,38.1 76.71,34.8 77.04,34.47 U3.8
RA6
  Top 0.305: 72.2,40.39 73.41,40.39 76.2,37.59 76.2,34.29 76.82,33.67 U3.9
  Top 0.406: 72.2,40.39 U5.6
RA7
  Top 0.305: U5.4 73.39,37.86 75.18,36.07 75.18,33.27 76.39,32.07 U3.11
RA8
  Top 0.305: U5.2 73.39,35.32 74.17,34.54 74.17,32.51 77.98,28.7 81.03,28.7 81.42,29.1 U3.14
RB1
  Top 0.406: U3.41 82.22,43.36 84.58,45.72 84.58,50.8 87.95,54.16 U4.7
RB2
  Top 0.406: U3.39 83.82,42.93 86.11,45.21 86.11,49.78 87.95,51.62 U4.5
RB3
  Top 0.406: U3.36 86.22,43.04 87.63,44.45 87.63,48.77 87.95,49.08 U4.3
RB4
  Top 0.406: U3.32 90.58,39.27 90.93,39.62 90.93,40.64 90.68,40.89 89.15,40.89 88.65,41.4 88.65,43.43 89.92,44.7 89.92,45.21 90.68,45.97 90.68,47.5 90.36,47.81 U4.2
RB5
  Top 0.305: U3.3 77.1,38.47 76.45,39.12 76.45,40.39 73.91,42.93 72.2,42.93
  Top 0.406: U5.8 72.2,42.93
RB6
  Top 0.305: U5.5 73.39,39.13 75.69,36.83 75.69,33.78 76.61,32.87 U3.10
RB7
  Top 0.305: U5.3 73.39,36.59 74.68,35.31 74.68,32.77 76.2,31.24 78.99,31.24 79.5,31.75 84.84,31.75 85.42,31.17 U3.19
RB8
  Top 0.305: U5.1 72.19,33.48 77.72,27.94 81.28,27.94 82.22,28.88 U3.15
RS485_A  (via drill 0.6)
  Top 0.61: U2.6 85.47,72.52 v85.34,72.64
  Bottom 0.61: v85.34,72.64 82.83,75.16 82.83,76.99 J1.P$1 J1.P$5 82.5,80.59 81.81,81.28 JP1.2
RS485_B  (via drill 0.6)
  Top 0.61: 84.2,68.71 v84.07,68.58 84.2,68.58 U2.7 84.2,71.75 83.57,72.39 80.64,72.39 80.14,71.88 80.14,69.57 R3.1
  Bottom 0.61: v84.07,68.58 87.86,72.36 87.86,77.02 J1.P$2 J1.P$6
RS485_DIR
  Top 0.305: U2.3 U2.2
  Top 0.406: U3.2 79.15,39.27 79.5,39.62 79.5,40.39 78.99,40.89 78.99,43.18 81.79,45.97 81.79,52.58 84.34,55.13 84.34,61.48 85.47,62.61 U2.3
RS485_RX
  Top 0.406: U3.1 78.02,43.22 81.03,46.23 81.03,52.83 83.67,55.48 83.67,62.12 82.93,62.87 U2.1
RS485_TX
  Top 0.406: U3.44 79.82,42.99 82.55,45.72 82.55,52.32 85.1,54.87 85.1,61.22 86.74,62.87 U2.4
SCL  (via drill 0.6)
  Top 0.406: J3.P$4 98.81,51.31 97.03,49.53 94.99,49.53 v92.7,47.24 92.65,47.2 R2.2 | v87.63,39.88 86.61,39.88 85.42,41.07 U3.37
  Bottom 0.406: v92.7,47.24 92.7,43.94 90.67,41.91 89.66,41.91 v87.63,39.88
SDA  (via drill 0.6)
  Top 0.406: J3.P$5 94.49,50.8 91.44,47.75 91.44,44.7 v90.42,43.69 89.81,43.07 R1.2 | v85.34,39.88 82.3,39.88 81.42,40.75 U3.42
  Bottom 0.406: v90.42,43.69 89.15,43.69 v85.34,39.88
STAT1
  Top 0.406: U3.27 91.1,35.27 93.98,32.38 93.98,28.22 95,27.21 99.06,27.21 99.95,28.09 100.2,47.24 99.19,48.26 J3.P$7
STAT2
  Top 0.406: U3.26 90.88,34.47 93.22,32.13 93.22,27.97 94.74,26.44 99.32,26.44 100.97,28.09 100.97,47.75 99.19,49.53 J3.P$6